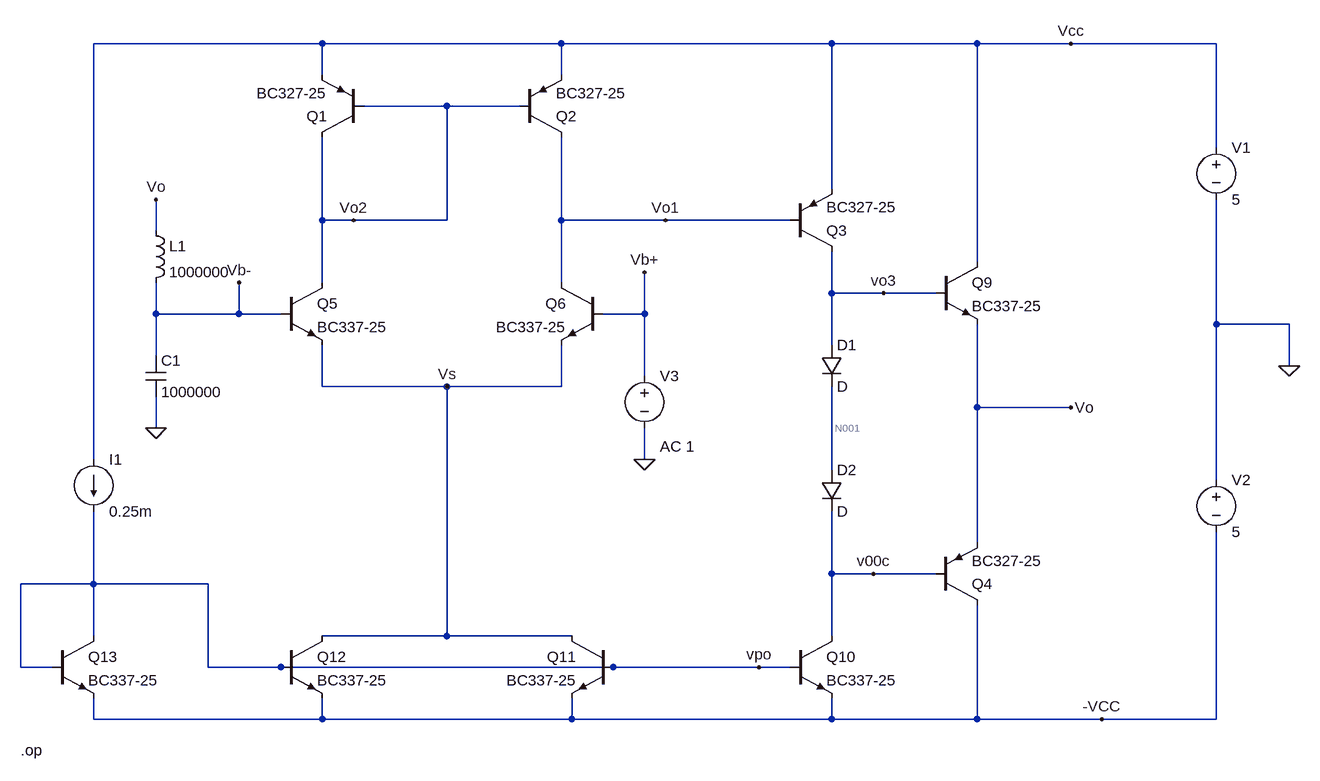
[diagram p0: schematic TP_SIM.asc]
TP_SIM.asc, the LTspice schematic file:
Version 4
SHEET 1 1748 1120
WIRE 240 16 -112 16
WIRE 608 16 240 16
WIRE 1024 16 608 16
WIRE 1248 16 1024 16
WIRE 1392 16 1248 16
WIRE 1616 16 1392 16
WIRE 240 64 240 16
WIRE 608 64 608 16
WIRE 432 112 304 112
WIRE 544 112 432 112
WIRE 1616 176 1616 16
WIRE 1024 240 1024 16
WIRE 240 288 240 160
WIRE 288 288 240 288
WIRE 432 288 432 112
WIRE 432 288 288 288
WIRE 608 288 608 160
WIRE 768 288 608 288
WIRE 960 288 768 288
WIRE -16 304 -16 256
WIRE 1248 352 1248 16
WIRE 240 384 240 288
WIRE 608 384 608 288
WIRE 1024 400 1024 336
WIRE 1104 400 1024 400
WIRE 1184 400 1104 400
WIRE -16 432 -16 384
WIRE 112 432 112 384
WIRE 112 432 -16 432
WIRE 176 432 112 432
WIRE 736 432 736 368
WIRE 736 432 672 432
WIRE 1616 448 1616 256
WIRE 1728 448 1616 448
WIRE 1024 480 1024 400
WIRE -16 496 -16 432
WIRE 1728 512 1728 448
WIRE 736 528 736 432
WIRE 240 544 240 480
WIRE 432 544 240 544
WIRE 608 544 608 480
WIRE 608 544 432 544
WIRE 1248 576 1248 448
WIRE 1392 576 1248 576
WIRE -16 608 -16 560
WIRE -112 656 -112 16
WIRE 736 656 736 608
WIRE 1024 672 1024 544
WIRE 1616 688 1616 448
WIRE 1248 784 1248 576
WIRE 1024 832 1024 736
WIRE 1088 832 1024 832
WIRE 1184 832 1088 832
WIRE -112 848 -112 736
WIRE -112 848 -224 848
WIRE 64 848 -112 848
WIRE -112 928 -112 848
WIRE 432 928 432 544
WIRE 432 928 240 928
WIRE 624 928 432 928
WIRE 1024 928 1024 832
WIRE -224 976 -224 848
WIRE -176 976 -224 976
WIRE 64 976 64 848
WIRE 176 976 64 976
WIRE 688 976 176 976
WIRE 912 976 688 976
WIRE 960 976 912 976
WIRE -112 1056 -112 1024
WIRE 240 1056 240 1024
WIRE 240 1056 -112 1056
WIRE 624 1056 624 1024
WIRE 624 1056 240 1056
WIRE 1024 1056 1024 1024
WIRE 1024 1056 624 1056
WIRE 1248 1056 1248 880
WIRE 1248 1056 1024 1056
WIRE 1440 1056 1248 1056
WIRE 1616 1056 1616 768
WIRE 1616 1056 1440 1056
FLAG 1392 576 Vo
FLAG 1104 400 vo3
FLAG 1088 832 v00c
FLAG 912 976 vpo
FLAG 1440 1056 -VCC
FLAG 1392 16 Vcc
FLAG 112 384 Vb-
FLAG 736 368 Vb+
FLAG -16 256 Vo
FLAG 736 656 0
FLAG 1728 512 0
FLAG 768 288 Vo1
FLAG 288 288 Vo2
FLAG -16 608 0
FLAG 432 544 Vs
SYMBOL pnp 304 160 R180
SYMATTR InstName Q1
SYMATTR Value BC327-25
SYMBOL pnp 544 160 M180
SYMATTR InstName Q2
SYMATTR Value BC327-25
SYMBOL pnp 960 336 M180
SYMATTR InstName Q3
SYMATTR Value BC327-25
SYMBOL pnp 1184 880 M180
SYMATTR InstName Q4
SYMATTR Value BC327-25
SYMBOL npn 176 384 R0
SYMATTR InstName Q5
SYMATTR Value BC337-25
SYMBOL npn 672 384 M0
SYMATTR InstName Q6
SYMATTR Value BC337-25
SYMBOL npn 1184 352 R0
SYMATTR InstName Q9
SYMATTR Value BC337-25
SYMBOL npn 960 928 R0
SYMATTR InstName Q10
SYMATTR Value BC337-25
SYMBOL npn 688 928 M0
SYMATTR InstName Q11
SYMATTR Value BC337-25
SYMBOL npn 176 928 R0
SYMATTR InstName Q12
SYMATTR Value BC337-25
SYMBOL npn -176 928 R0
SYMATTR InstName Q13
SYMATTR Value BC337-25
SYMBOL diode 1008 480 R0
SYMATTR InstName D1
SYMBOL diode 1008 672 R0
SYMATTR InstName D2
SYMBOL current -112 656 R0
WINDOW 123 0 0 Left 0
WINDOW 39 0 0 Left 0
SYMATTR InstName I1
SYMATTR Value 0.25m
SYMBOL voltage 1616 160 R0
WINDOW 123 0 0 Left 0
WINDOW 39 0 0 Left 0
SYMATTR InstName V1
SYMATTR Value 5
SYMBOL voltage 1616 672 R0
WINDOW 123 0 0 Left 0
WINDOW 39 0 0 Left 0
SYMATTR InstName V2
SYMATTR Value 5
SYMBOL voltage 736 512 R0
WINDOW 123 24 124 Left 2
WINDOW 39 0 0 Left 0
SYMATTR Value2 AC 1
SYMATTR InstName V3
SYMATTR Value ""
SYMBOL ind -32 288 R0
SYMATTR InstName L1
SYMATTR Value 1000000
SYMBOL cap -32 496 R0
SYMATTR InstName C1
SYMATTR Value 1000000
TEXT -224 1104 Left 2 !.op

The netlist it stands for:
* TP_SIM.asc
Q1 Vo2 Vo2 Vcc 0 BC327-25
Q2 Vo1 Vo2 Vcc 0 BC327-25
Q3 vo3 Vo1 Vcc 0 BC327-25
Q4 -VCC v00c Vo 0 BC327-25
Q5 Vo2 Vb- Vs 0 BC337-25
Q6 Vo1 Vb+ Vs 0 BC337-25
Q9 Vcc vo3 Vo 0 BC337-25
Q10 v00c vpo -VCC 0 BC337-25
Q11 Vs vpo -VCC 0 BC337-25
Q12 Vs vpo -VCC 0 BC337-25
Q13 vpo vpo -VCC 0 BC337-25
D1 vo3 N001 D
D2 N001 v00c D
I1 Vcc vpo 0.25m
V1 Vcc 0 5
V2 0 -VCC 5
V3 Vb+ 0 AC 1
L1 Vo Vb- 1000000
C1 Vb- 0 1000000
.model D D
.lib standard.dio
.model NPN NPN
.model PNP PNP
.lib standard.bjt
.op
.backanno
.end

* Results of the author's LTspice run, read from the files saved beside the schematic
* Operating Point:
*   V(vo2) = 4.446 V
*   V(vcc) = 5 V
*   V(vo1) = 4.449 V
*   V(vo3) = 630.1 mV
*   V(-vcc) = -5 V
*   V(v00c) = -607.8 mV
*   V(vo) = 91.65 µV
*   V(vb-) = 91.65 µV
*   V(vs) = -572.4 mV
*   V(vb+) = 0 V
*   V(vpo) = -4.427 V
*   V(n001) = 11.15 mV
*   Ic(Q13) = 246.3 µA
*   Ib(Q13) = 914.3 nA
*   Ie(Q13) = -247.3 µA
*   Ic(Q12) = 253 µA
*   Ib(Q12) = 914.3 nA
*   Ie(Q12) = -254 µA
*   Ic(Q11) = 253 µA
*   Ib(Q11) = 914.3 nA
*   Ie(Q11) = -254 µA
*   Ic(Q10) = 253 µA
*   Ib(Q10) = 914.3 nA
*   Ie(Q10) = -253.9 µA
*   Ic(Q9) = 2.352 mA
*   Ib(Q9) = 8.313 µA
*   Ie(Q9) = -2.36 mA
*   Ic(Q6) = 251.7 µA
*   Ib(Q6) = 905.8 nA
*   Ie(Q6) = -252.6 µA
*   Ic(Q5) = 252.6 µA
*   Ib(Q5) = 909 nA
*   Ie(Q5) = -253.5 µA
*   Ic(Q4) = -2.353 mA
*   Ib(Q4) = -6.165 µA
*   Ie(Q4) = 2.359 mA
*   Ic(Q3) = -255.1 µA
*   Ib(Q3) = -725.5 nA
*   Ie(Q3) = 255.9 µA
*   Ic(Q2) = -251 µA
*   Ib(Q2) = -801.8 nA
*   Ie(Q2) = 251.8 µA
*   Ic(Q1) = -251 µA
*   Ib(Q1) = -801.8 nA
*   Ie(Q1) = 251.8 µA
*   I(C1) = 91.65 pA
*   I(D2) = 246.8 µA
*   I(D1) = 246.8 µA
*   I(L1) = 909.1 nA
*   I(I1) = 250 µA
*   I(V3) = -905.8 nA
*   I(V2) = -3.362 mA
*   I(V1) = -3.361 mA
* From the log:
*   Semiconductor Device Operating Points:
*                           --- Diodes ---
*   Name:      d2          d1
*   Model:      d           d
*   Id:      2.47e-04    2.47e-04
*   Vd:      6.19e-01    6.19e-01
*   Req:     1.05e+02    1.05e+02
*   CAP:     0.00e+00    0.00e+00
*                           --- Bipolar Transistors ---
*   Name:       q13         q12         q11         q10         q9
*   Model:   bc337-25    bc337-25    bc337-25    bc337-25    bc337-25
*   Ib:       9.14e-07    9.14e-07    9.14e-07    9.14e-07    8.31e-06
*   Ic:       2.46e-04    2.53e-04    2.53e-04    2.53e-04    2.35e-03
*   Vbe:      5.73e-01    5.73e-01    5.73e-01    5.73e-01    6.30e-01
*   Vbc:      0.00e+00   -3.85e+00   -3.85e+00   -3.82e+00   -4.37e+00
*   Vce:      5.73e-01    4.43e+00    4.43e+00    4.39e+00    5.00e+00
*   BetaDC:   2.69e+02    2.77e+02    2.77e+02    2.77e+02    2.83e+02
*   Gm:       9.68e-03    9.94e-03    9.94e-03    9.94e-03    9.22e-02
*   Rpi:      2.82e+04    2.82e+04    2.82e+04    2.82e+04    3.08e+03
*   Rx:       5.94e+01    5.94e+01    5.94e+01    5.94e+01    5.58e+01
*   Ro:       5.75e+05    5.75e+05    5.75e+05    5.75e+05    6.19e+04
*   Cbe:      7.05e-11    7.07e-11    7.07e-11    7.07e-11    1.20e-10
*   Cbc:      6.17e-12    2.38e-12    2.38e-12    2.39e-12    2.28e-12
*   Cjs:      0.00e+00    0.00e+00    0.00e+00    0.00e+00    0.00e+00
*   BetaAC:   2.73e+02    2.80e+02    2.80e+02    2.80e+02    2.84e+02
*   Cbx:      7.39e-12    2.86e-12    2.86e-12    2.86e-12    2.73e-12
*   Ft:       1.83e+07    2.08e+07    2.08e+07    2.08e+07    1.18e+08
*   Name:       q6          q5          q4          q3          q2
*   Model:   bc337-25    bc337-25    bc327-25    bc327-25    bc327-25
*   Ib:       9.06e-07    9.09e-07   -6.16e-06   -7.26e-07   -8.02e-07
*   Ic:       2.52e-04    2.53e-04   -2.35e-03   -2.55e-04   -2.51e-04
*   Vbe:      5.72e-01    5.73e-01   -6.08e-01   -5.51e-01   -5.54e-01
*   Vbc:     -4.45e+00   -4.45e+00    4.39e+00    3.82e+00   -2.67e-03
*   Vce:      5.02e+00    5.02e+00   -5.00e+00   -4.37e+00   -5.51e-01
*   BetaDC:   2.78e+02    2.78e+02    3.82e+02    3.52e+02    3.13e+02
*   Gm:       9.89e-03    9.93e-03    9.11e-02    9.93e-03    9.76e-03
*   Rpi:      2.84e+04    2.83e+04    4.26e+03    3.69e+04    3.34e+04
*   Rx:       5.94e+01    5.94e+01    6.30e-01    7.78e-01    7.70e-01
*   Ro:       5.80e+05    5.78e+05    1.45e+04    1.32e+05    1.19e+05
*   Cbe:      7.06e-11    7.07e-11    1.52e-10    8.56e-11    8.57e-11
*   Cbc:      2.27e-12    2.27e-12    4.44e-12    4.71e-12    1.22e-11
*   Cjs:      0.00e+00    0.00e+00    0.00e+00    0.00e+00    0.00e+00
*   BetaAC:   2.81e+02    2.81e+02    3.88e+02    3.67e+02    3.26e+02
*   Cbx:      2.71e-12    2.72e-12    5.23e-12    5.55e-12    1.44e-11
*   Ft:       2.08e+07    2.09e+07    8.97e+07    1.65e+07    1.38e+07
*   Name:       q1
*   Model:   bc327-25
*   Ib:      -8.02e-07
*   Ic:      -2.51e-04
*   Vbe:     -5.54e-01
*   Vbc:      0.00e+00
*   Vce:     -5.54e-01
*   BetaDC:   3.13e+02
*   Gm:       9.76e-03
*   Rpi:      3.34e+04
*   Rx:       7.70e-01
*   Ro:       1.19e+05
*   Cbe:      8.57e-11
*   Cbc:      1.22e-11
*   Cjs:      0.00e+00
*   BetaAC:   3.26e+02
*   Cbx:      1.44e-11
*   Ft:       1.38e+07